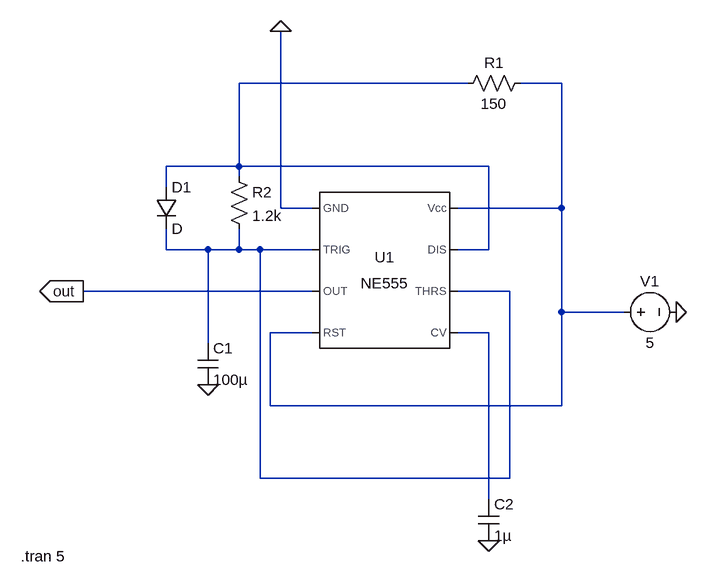
[diagram p0: schematic MLI_app2_10_final.asc]
MLI_app2_10_final.asc, the LTspice schematic file:
Version 4
SHEET 1 1532 728
WIRE 288 -480 -64 -480
WIRE 432 -480 368 -480
WIRE -64 -352 -64 -480
WIRE -64 -352 -176 -352
WIRE 320 -352 -64 -352
WIRE -64 -336 -64 -352
WIRE -176 -320 -176 -352
WIRE 0 -288 0 -560
WIRE 48 -288 0 -288
WIRE 432 -288 432 -480
WIRE 432 -288 272 -288
WIRE -176 -224 -176 -256
WIRE -112 -224 -176 -224
WIRE -64 -224 -64 -256
WIRE -64 -224 -112 -224
WIRE -32 -224 -64 -224
WIRE 48 -224 -32 -224
WIRE 320 -224 320 -352
WIRE 320 -224 272 -224
WIRE 48 -160 -304 -160
WIRE 352 -160 272 -160
WIRE 432 -128 432 -288
WIRE 528 -128 432 -128
WIRE 48 -96 -16 -96
WIRE 320 -96 272 -96
WIRE -112 -80 -112 -224
WIRE -16 16 -16 -96
WIRE 432 16 432 -128
WIRE 432 16 -16 16
WIRE -32 128 -32 -224
WIRE 352 128 352 -160
WIRE 352 128 -32 128
WIRE 320 160 320 -96
FLAG -304 -160 out
IOPIN -304 -160 Out
FLAG 608 -128 0
FLAG -112 -16 0
FLAG 0 -560 0
FLAG 320 224 0
SYMBOL Misc\\NE555 160 -192 R0
SYMATTR InstName U1
SYMBOL diode -192 -320 R0
SYMATTR InstName D1
SYMBOL voltage 512 -128 R270
WINDOW 0 32 56 VTop 2
WINDOW 3 -32 56 VBottom 2
SYMATTR InstName V1
SYMATTR Value 5
SYMBOL res 384 -496 R90
WINDOW 0 0 56 VBottom 2
WINDOW 3 32 56 VTop 2
SYMATTR InstName R1
SYMATTR Value 150
SYMBOL res -80 -352 R0
SYMATTR InstName R2
SYMATTR Value 1.2k
SYMBOL cap -128 -80 R0
SYMATTR InstName C1
SYMATTR Value 100µ
SYMBOL cap 304 160 R0
SYMATTR InstName C2
SYMATTR Value 1µ
TEXT -400 248 Left 2 !.tran 5

The netlist it stands for:
* MLI_app2_10_final.asc
XU1 0 N003 out N002 N004 N003 N001 N002 NE555  ; pins GND TRIG OUT RST CV THRS DIS Vcc
D1 N001 N003 D
V1 N002 0 5
R1 N002 N001 150
R2 N001 N003 1.2k
C1 N003 0 100µ
C2 N004 0 1µ
.model D D
.lib standard.dio
.tran 5
.lib NE555.sub
.backanno
.end